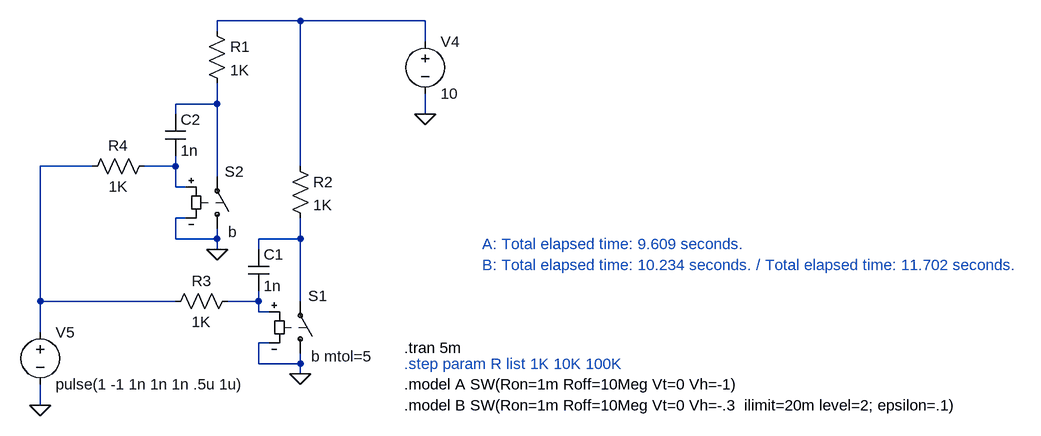
[diagram p0: schematic CommonEmit.asc]
CommonEmit.asc, the LTspice schematic file:
Version 4
SHEET 1 1276 680
WIRE 0 -560 -128 -560
WIRE 192 -560 0 -560
WIRE -128 -544 -128 -560
WIRE 192 -528 192 -560
WIRE -128 -432 -128 -464
WIRE -128 -432 -192 -432
WIRE -192 -416 -192 -432
WIRE 192 -416 192 -448
WIRE -320 -336 -400 -336
WIRE -192 -336 -192 -352
WIRE -192 -336 -240 -336
WIRE 0 -336 0 -560
WIRE -128 -320 -128 -432
WIRE -192 -304 -192 -336
WIRE -176 -304 -192 -304
WIRE -176 -256 -192 -256
WIRE -192 -224 -192 -256
WIRE -128 -224 -128 -240
WIRE -128 -224 -192 -224
WIRE 0 -224 0 -256
WIRE 0 -224 -64 -224
WIRE -128 -208 -128 -224
WIRE -64 -208 -64 -224
WIRE -400 -128 -400 -336
WIRE -192 -128 -400 -128
WIRE -64 -128 -64 -144
WIRE -64 -128 -112 -128
WIRE 0 -128 0 -224
WIRE -64 -112 -64 -128
WIRE -48 -112 -64 -112
WIRE -400 -80 -400 -128
WIRE -48 -64 -64 -64
WIRE -64 -32 -64 -64
WIRE 0 -32 0 -48
WIRE 0 -32 -64 -32
WIRE 0 -16 0 -32
WIRE -400 32 -400 0
FLAG -400 32 0
FLAG 192 -416 0
FLAG 0 -16 0
FLAG -128 -208 0
SYMBOL sw 0 -32 M180
WINDOW 0 12 104 Left 2
WINDOW 3 17 11 Left 2
SYMATTR InstName S1
SYMATTR Value b mtol=5
SYMBOL voltage 192 -544 R0
SYMATTR Value 10
SYMATTR InstName V4
SYMBOL voltage -400 -96 R0
SYMATTR InstName V5
SYMATTR Value pulse(1 -1 1n 1n 1n .5u 1u)
SYMBOL res -16 -352 R0
SYMATTR InstName R2
SYMATTR Value 1K
SYMBOL res -96 -144 R90
WINDOW 0 0 56 VBottom 2
WINDOW 3 32 56 VTop 2
SYMATTR InstName R3
SYMATTR Value 1K
SYMBOL cap -80 -208 R0
SYMATTR InstName C1
SYMATTR Value 1n
SYMBOL sw -128 -224 M180
WINDOW 0 12 104 Left 2
WINDOW 3 17 11 Left 2
SYMATTR InstName S2
SYMATTR Value b
SYMBOL res -144 -560 R0
SYMATTR InstName R1
SYMATTR Value 1K
SYMBOL res -224 -352 R90
WINDOW 0 0 56 VBottom 2
WINDOW 3 32 56 VTop 2
SYMATTR InstName R4
SYMATTR Value 1K
SYMBOL cap -208 -416 R0
SYMATTR InstName C2
SYMATTR Value 1n
TEXT 160 32 Left 2 !.model B SW(Ron=1m Roff=10Meg Vt=0 Vh=-.3  ilimit=20m level=2; epsilon=.1)
TEXT 160 -56 Left 2 !.tran 5m
TEXT 160 0 Left 2 !.model A SW(Ron=1m Roff=10Meg Vt=0 Vh=-1)
TEXT 160 -32 Left 2 ;.step param R list 1K 10K 100K
TEXT 280 -216 Left 2 ;A: Total elapsed time: 9.609 seconds.
TEXT 280 -184 Left 2 ;B: Total elapsed time: 10.234 seconds. / Total elapsed time: 11.702 seconds.

The netlist it stands for:
* CommonEmit.asc
S1 0 N005 N006 0 b mtol=5
V4 N001 0 10
V5 N003 0 pulse(1 -1 1n 1n 1n .5u 1u)
R2 N001 N005 1K
R3 N006 N003 1K
C1 N005 N006 1n
S2 0 N002 N004 0 b
R1 N001 N002 1K
R4 N004 N003 1K
C2 N002 N004 1n
.model B SW(Ron=1m Roff=10Meg Vt=0 Vh=-.3  ilimit=20m level=2; epsilon=.1)
.tran 5m
.model A SW(Ron=1m Roff=10Meg Vt=0 Vh=-1)
* .step param R list 1K 10K 100K
* A: Total elapsed time: 9.609 seconds.
* B: Total elapsed time: 10.234 seconds. / Total elapsed time: 11.702 seconds.
.backanno
.end